# EAGLE design erősítő (EAGLE 9.0.0)
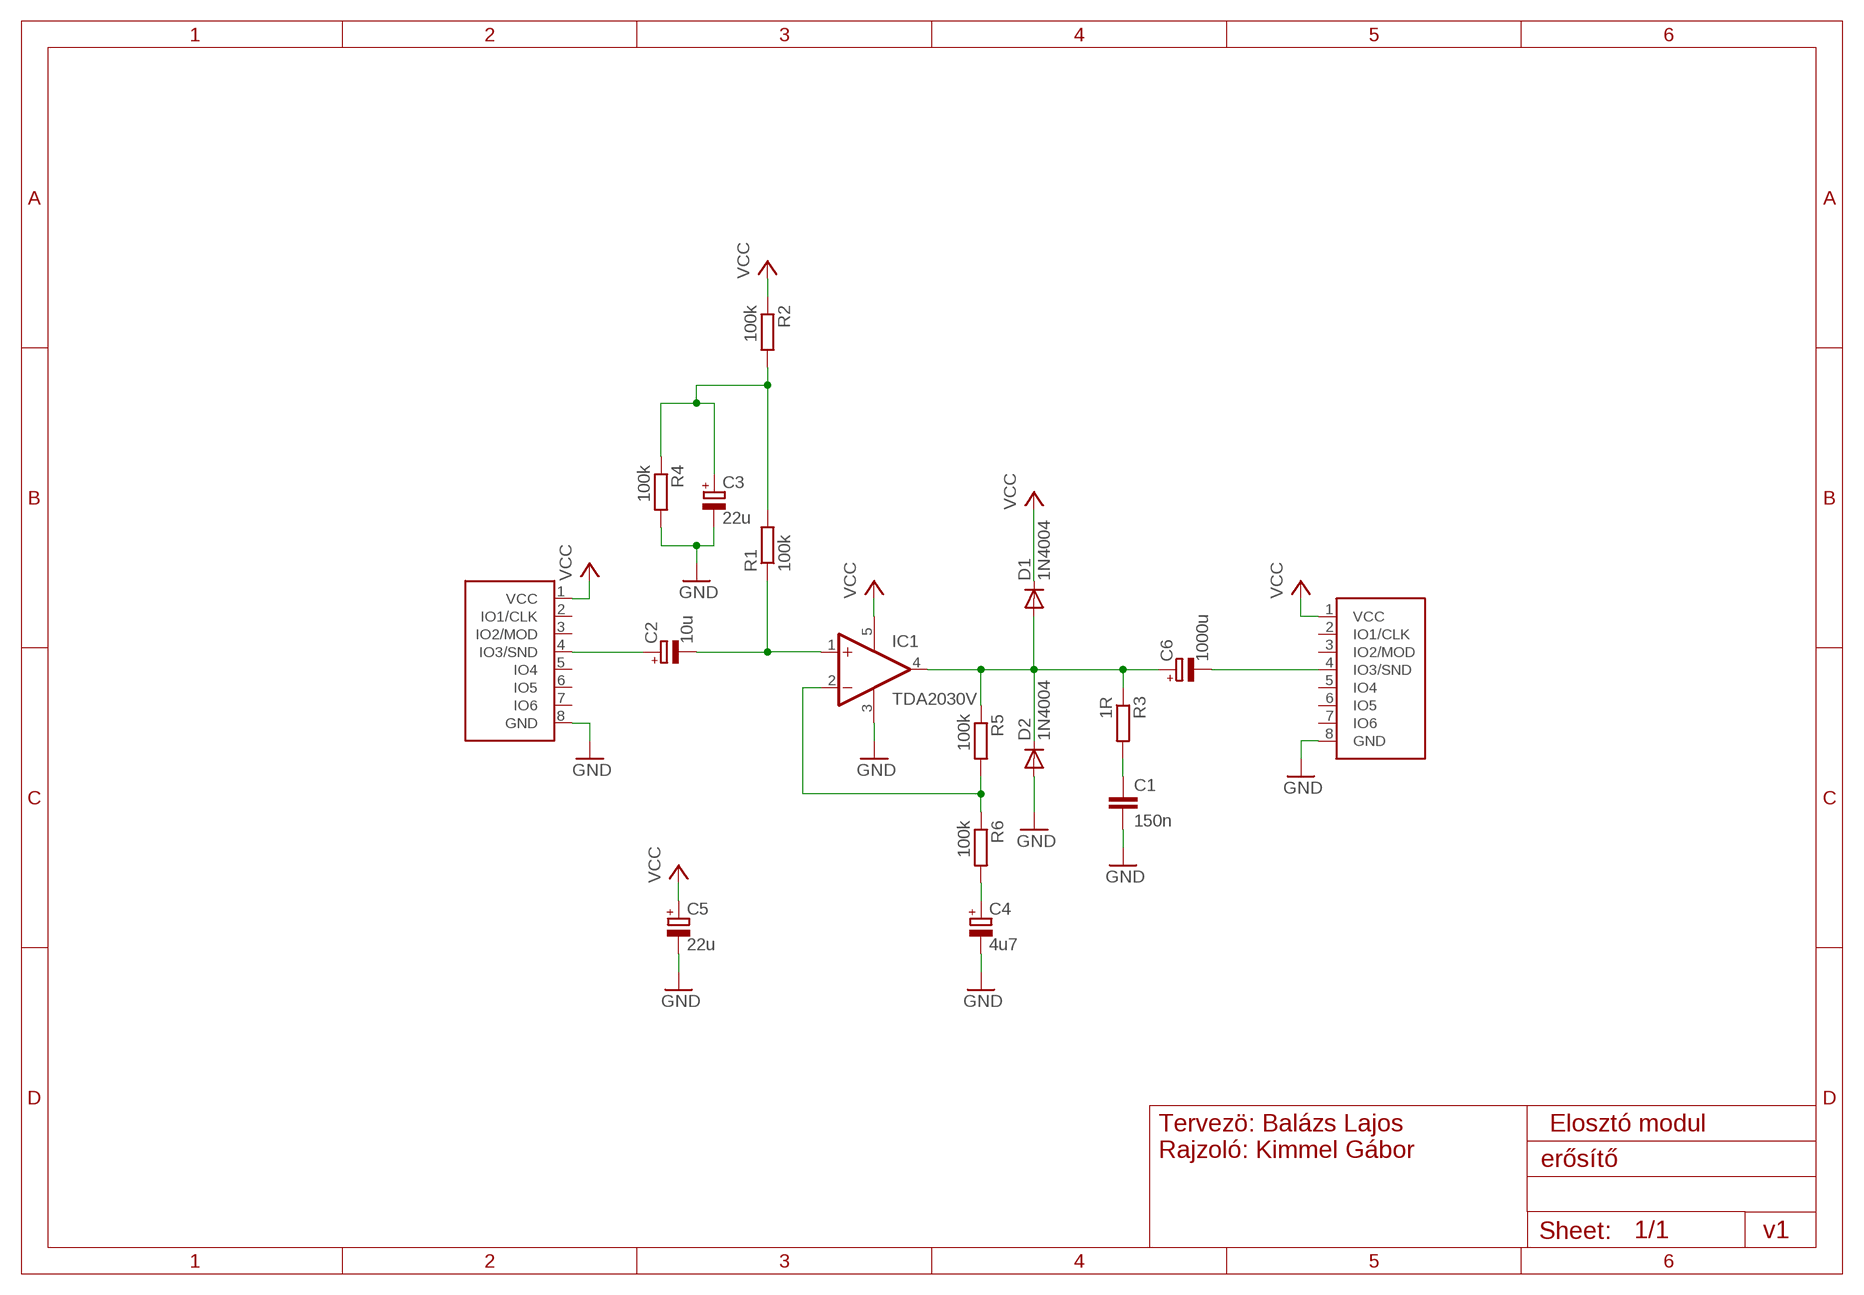
[diagram p0: schematic, sheet 1]

## Parts
C1  150n  C-EU075-032X103  [C075-032X103]
C2  10u  CPOL-EUE2.5-7  [E2,5-7]
C3  22u  CPOL-EUE2.5-7  [E2,5-7]
C4  4u7  CPOL-EUE2.5-7  [E2,5-7]
C5  22u  CPOL-EUE2.5-7  [E2,5-7]
C6  1000u  CPOL-EUE3.5-8  [E3,5-8]
D1  1N4004  [DO41-10]
D2  1N4004  [DO41-10]
IC1  TDA2030V  [CB360]
R1  100k  R-EU_0309/12  [0309/12]
R2  100k  R-EU_0309/12  [0309/12]
R3  1R  R-EU_0309/12  [0309/12]
R4  100k  R-EU_0309/12  [0309/12]
R5  100k  R-EU_0309/12  [0309/12]
R6  100k  R-EU_0309/12  [0309/12]
U$1  GANZ-CONNECTOR  [FE08W]
U$2  GANZ-CONNECTOR-OUT  [MA08-1W]

## Nets
GND: C1.2 C3.- C4.- C5.- D2.A IC1.3(GND) R4.2 U$1.8(GND) U$2.8(GND)
N$1: C6.+ D1.A D2.C IC1.4(OUT) R3.1 R5.1
N$2: C3.+ R1.2 R2.2 R4.1
N$3: C2.- IC1.1(+IN) R1.1
N$4: C2.+ U$1.4(IO3/SND)
N$5: IC1.2(-IN) R5.2 R6.1
N$6: C4.+ R6.2
N$7: C1.1 R3.2
N$8: C6.- U$2.4(IO3/SND)
VCC: C5.+ D1.C IC1.5(V+) R2.1 U$1.1(VCC) U$2.1(VCC)
Unconnected: U$1.2(IO1/CLK) U$1.3(IO2/MOD) U$1.5(IO4) U$1.6(IO5) U$1.7(IO6) U$2.2(IO1/CLK) U$2.3(IO2/MOD) U$2.5(IO4) U$2.6(IO5) U$2.7(IO6)

## Notes on the sheet
- Tervezö: Balázs Lajos
  Rajzoló: Kimmel Gábor
- Elosztó modul
- v1

## Library data of the parts
C1 = resistor:C-EU: CAPACITOR, European symbol
C2-C6 = resistor:CPOL-EU: POLARIZED CAPACITOR, European symbol
D1 D2 = diode:1N4004: DIODE general purpose rectifier, 1 A
IC1 = linear:TDA2030: Power OP AMP
R1-R6 = resistor:R-EU_: RESISTOR, European symbol
U$1 = ganzlib:GANZ-CONNECTOR
U$2 = ganzlib:GANZ-CONNECTOR-OUT

## Board
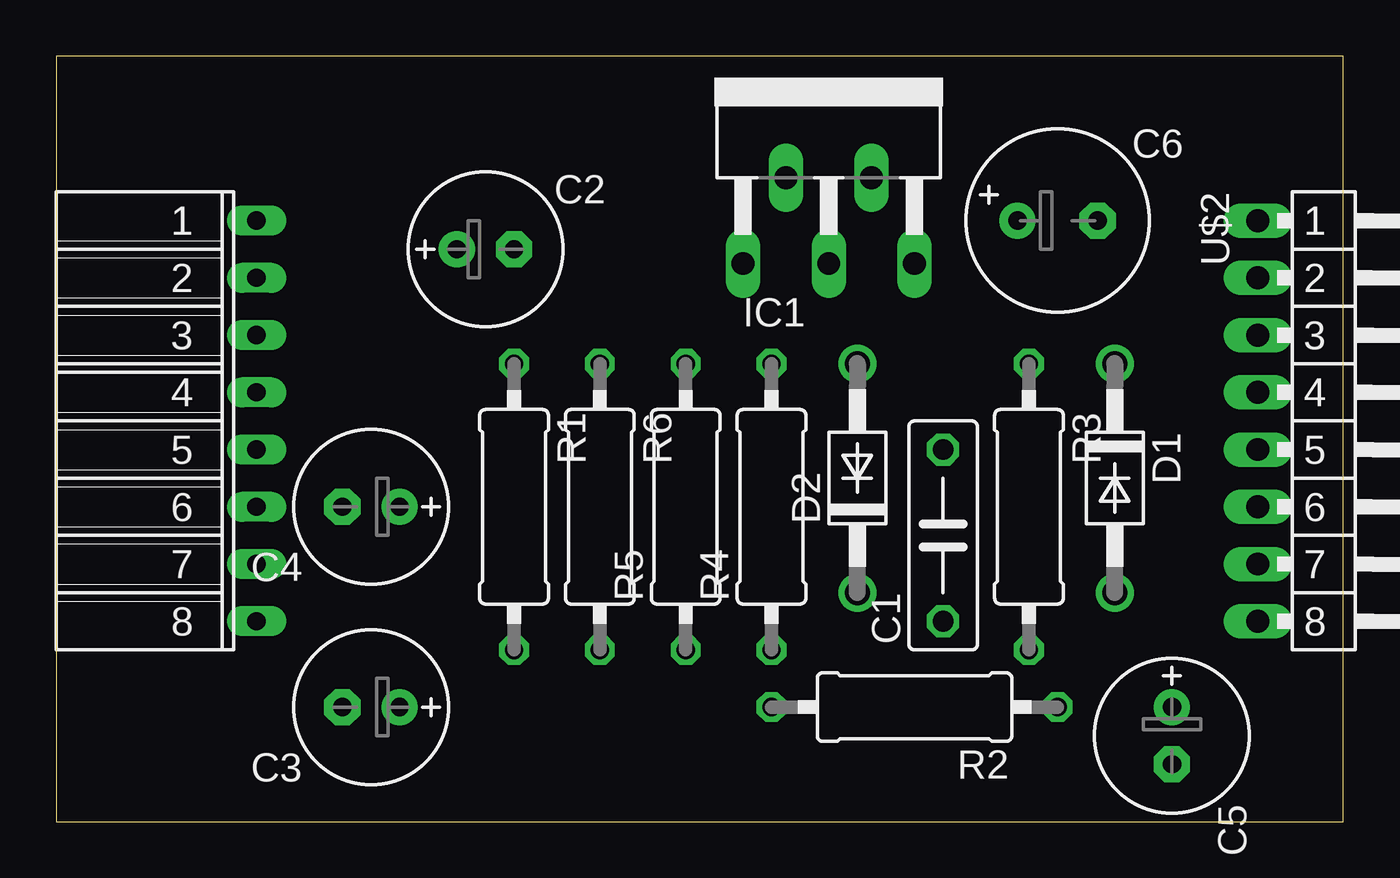
[diagram p1: board, top side]
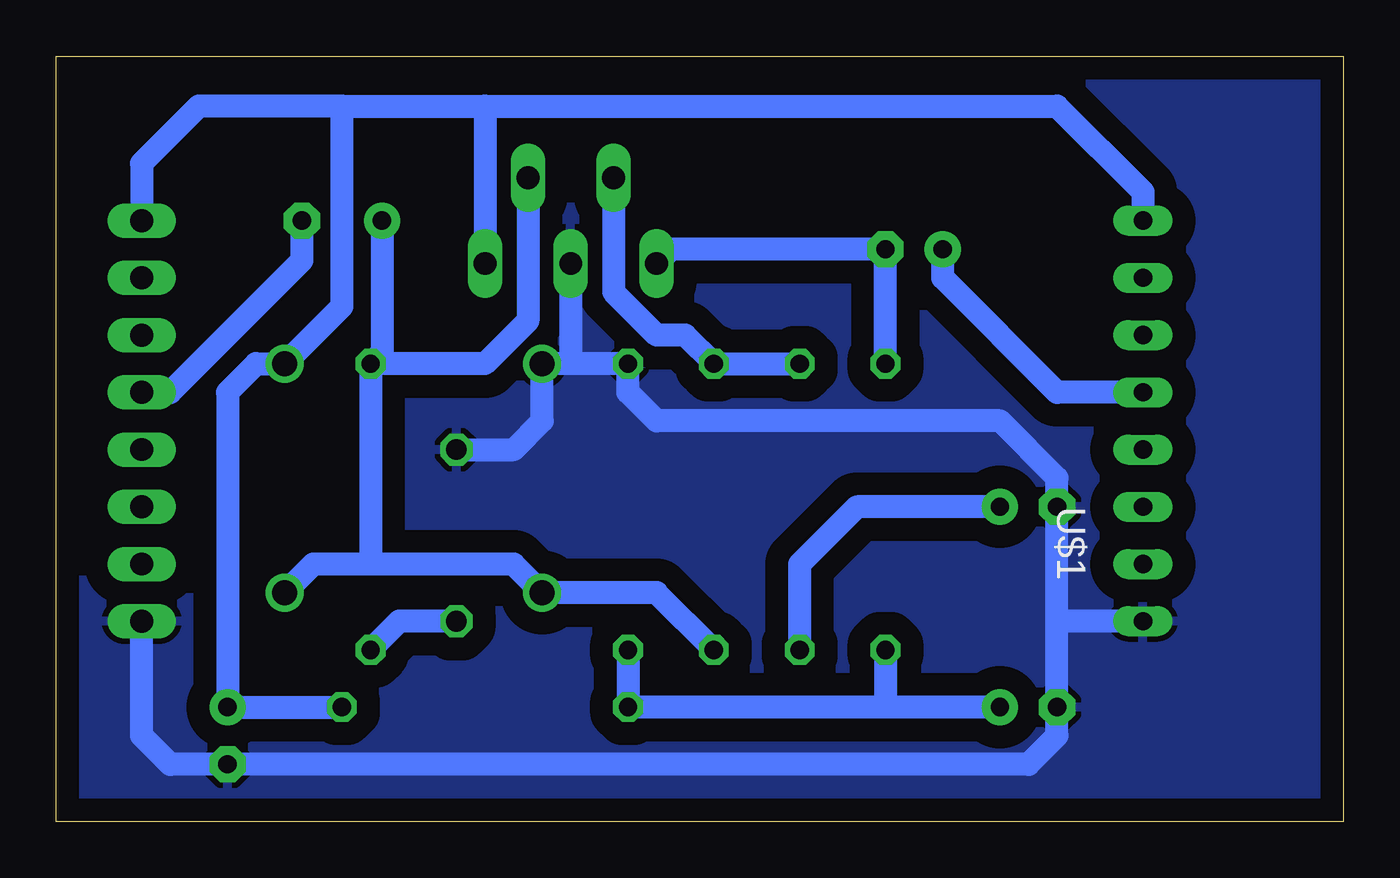
[diagram p2: board, bottom side, seen from below]

Size 57.13 x 33.96 mm. Coordinates in mm from the lower left corner, seen from the top.
Outline: 0,0 57.13,0 57.13,33.96 0,33.96 0,0
Copper layers (1*16): Top 0.035mm / dielectric 1.5mm / Bottom 0.035mm
Design rules "default *": minimum track width 10mil, minimum drill 24mil, track to track 8mil, track to pad 8mil, pad to pad 8mil, via to via 8mil, smd to smd 8mil, copper to edge 40mil, drill to drill 8mil, minimum pad ring 10mil, minimum via ring 8mil, stop-mask expansion 4mil, vias tented up to drill 0mil, thermal gap 10mil

### Footprints (pad centres in the part's own frame; a part is rotated, then mirrored left to right if it is on the bottom)
C075-032X103 = drill 0.914 octagon: 1 -3.81,0; 2 3.81,0
E2,5-7 = drill 0.813 pad 1.6: + -1.27,0 | drill 0.813 pad 1.6 octagon: - 1.27,0
E3,5-8 = drill 0.813 pad 1.6: + -1.778,0 | drill 0.813 pad 1.6 octagon: - 1.778,0
DO41-10 = drill 1.118: A 5.08,0; C -5.08,0
CB360 = drill 1.016 long: 1 -3.81,-8.255; 2 -1.905,-4.445; 3 0,-8.255; 4 1.905,-4.445; 5 3.81,-8.255
0309/12 = drill 0.813 octagon: 1 -6.35,0; 2 6.35,0
FE08W = drill 0.813 long: 1 5.08,8.89; 2 5.08,6.35; 3 5.08,3.81; 4 5.08,1.27; 5 5.08,-1.27; 6 5.08,-3.81; 7 5.08,-6.35; 8 5.08,-8.89
MA08-1W = drill 1.016 long: 1 0,8.89; 2 0,6.35; 3 0,3.81; 4 0,1.27; 5 0,-1.27; 6 0,-3.81; 7 0,-6.35; 8 0,-8.89

### Placement (x,y rotation side)
C1  39.37,12.7 90 top
C2  19.05,25.4 0 top
C3  13.97,5.08 180 top
C4  13.97,13.97 180 top
C5  49.53,3.81 270 top
C6  44.45,26.67 0 top
D1  46.99,15.24 270 top
D2  35.56,15.24 90 top
IC1  34.29,33.02 0 top
R1  20.32,13.97 270 top
R2  38.1,5.08 180 top
R3  43.18,13.97 270 top
R4  31.75,13.97 90 top
R5  27.94,13.97 90 top
R6  24.13,13.97 270 top
U$1  3.81,17.78 0 top
U$2  53.34,17.78 0 top

### Tracks (layer width: path | path; a pad name or v marks a point on that pad's centre or on a via)
GND
  Bottom 1.016: IC1.3 34.29,20.32 | 34.29,20.32 R4.2 31.75,19.05 30.48,17.78 15.24,17.78 12.7,15.24 C4.- 12.7,8.89 | 34.29,20.32 D2.A 35.56,17.78 36.83,16.51 C1.2 | 12.7,8.89 C3.- 12.7,3.81 13.97,2.54 C5.- 52.07,2.54 53.34,3.81 U$2.8 | U$1.8 12.7,8.89
  pour Bottom (isolate 1.016): 0,34.29 57.15,34.29 57.15,0 0,0
N$1
  Bottom 1.016: IC1.4 36.2,22.23 38.1,20.32 R3.1 | R5.1 30.48,10.16 D2.C 36.83,11.43 43.18,11.43 | 43.18,11.43 45.72,11.43 D1.A | R3.1 43.18,11.43 | C6.+ 42.67,20.83 R3.1
N$2
  Bottom 1.016: C3.+ 20.32,5.08 | 20.32,5.08 R2.2 R4.1 | R1.2 20.32,5.08
N$3
  Bottom 1.016: R1.1 C2.- 29.84,25.4 IC1.1
N$4
  Bottom 1.016: C2.+ 17.78,24.13 12.7,19.05 U$1.4
N$5
  Bottom 1.016: R6.1 R5.2 29.21,21.59 30.48,21.59 32.38,23.5 IC1.2
N$6
  Bottom 1.016: R6.2 24.13,11.43 21.59,13.97 C4.+
N$7
  Bottom 1.016: C1.1 41.91,8.89 R3.2
N$8
  Bottom 1.016: C6.- 46.23,24.89 52.07,19.05 U$2.4
VCC
  Bottom 1.016: 44.45,31.75 38.1,31.75 | 38.1,31.75 IC1.5 | 44.45,31.75 44.45,22.86 D1.C 48.26,20.32 49.53,19.05 C5.+ R2.1 | 38.1,31.75 12.7,31.75 8.89,27.94 U$1.1 | 44.45,31.75 50.8,31.75 53.34,29.21 U$2.1